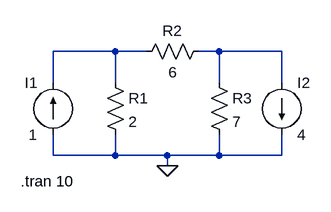
[diagram p0: schematic Q1.asc]
Q1.asc, the LTspice schematic file:
Version 4
SHEET 1 880 680
WIRE 176 80 80 80
WIRE 224 80 176 80
WIRE 336 80 304 80
WIRE 432 80 336 80
WIRE 80 128 80 80
WIRE 176 128 176 80
WIRE 336 128 336 80
WIRE 432 128 432 80
WIRE 80 240 80 208
WIRE 176 240 176 208
WIRE 176 240 80 240
WIRE 256 240 176 240
WIRE 336 240 336 208
WIRE 336 240 256 240
WIRE 432 240 432 208
WIRE 432 240 336 240
WIRE 256 256 256 240
FLAG 256 256 0
SYMBOL current 80 208 R180
WINDOW 0 24 80 Left 2
WINDOW 3 24 0 Left 2
WINDOW 123 0 0 Left 0
WINDOW 39 0 0 Left 0
SYMATTR InstName I1
SYMATTR Value 1
SYMBOL current 432 128 R0
WINDOW 123 0 0 Left 0
WINDOW 39 0 0 Left 0
SYMATTR InstName I2
SYMATTR Value 4
SYMBOL res 320 64 R90
WINDOW 0 0 56 VBottom 2
WINDOW 3 32 56 VTop 2
SYMATTR InstName R2
SYMATTR Value 6
SYMBOL res 160 112 R0
SYMATTR InstName R1
SYMATTR Value 2
SYMBOL res 320 112 R0
SYMATTR InstName R3
SYMATTR Value 7
TEXT 30 280 Left 2 !.tran 10

The netlist it stands for:
* Q1.asc
I1 0 N001 1
I2 N002 0 4
R2 N002 N001 6
R1 N001 0 2
R3 N002 0 7
.tran 10
.backanno
.end